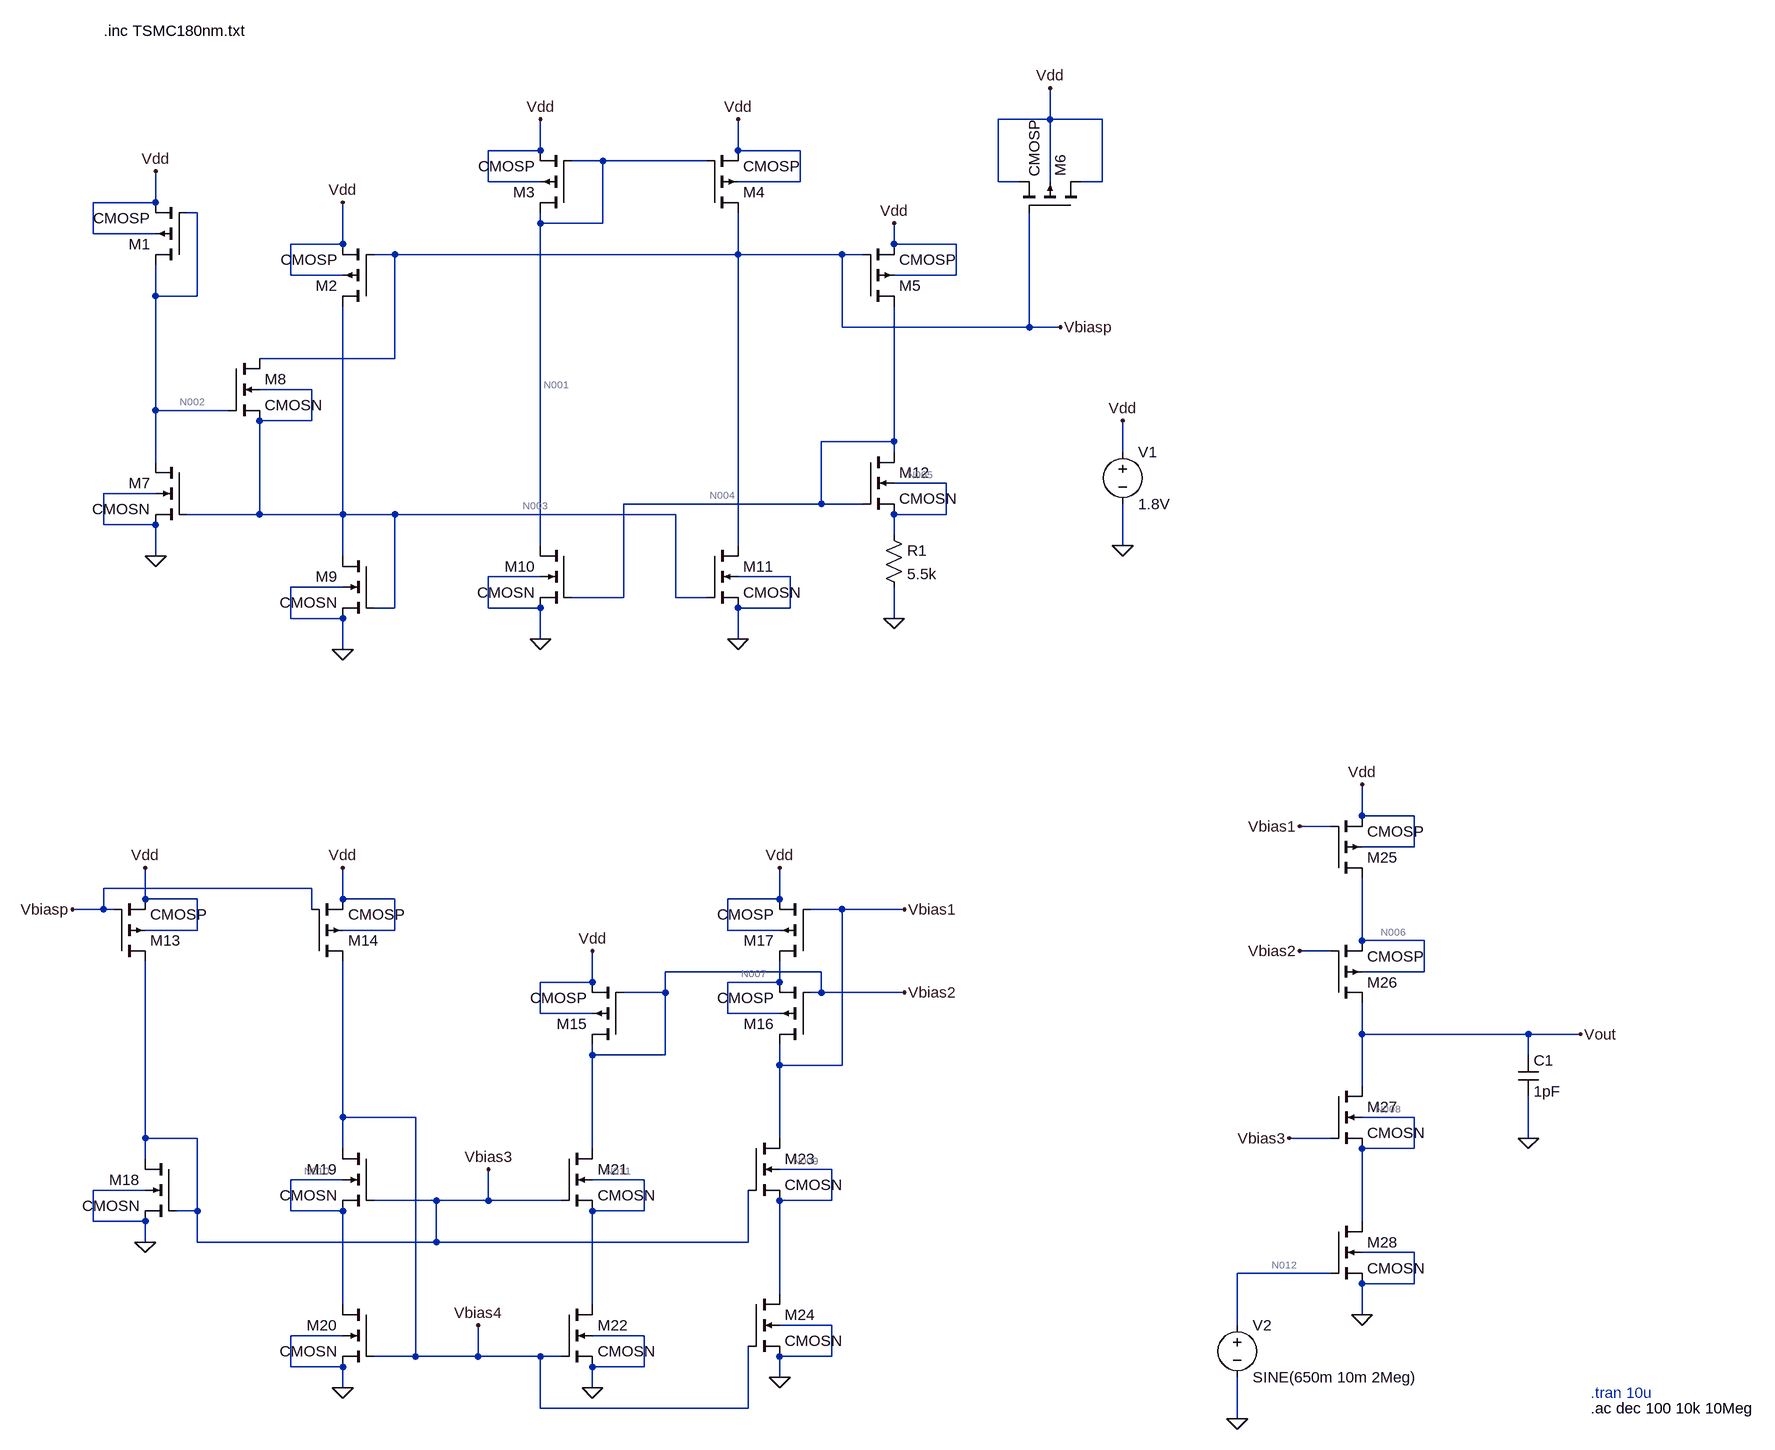
[diagram p0: schematic 180nm_schematic.asc]
180nm_schematic.asc, the LTspice schematic file:
Version 4
SHEET 1 2460 2152
WIRE 1360 112 1360 64
WIRE 1360 112 1280 112
WIRE 1440 112 1360 112
WIRE 576 160 576 112
WIRE 576 160 496 160
WIRE 880 160 880 112
WIRE 976 160 880 160
WIRE 576 176 576 160
WIRE 672 176 624 176
WIRE 832 176 672 176
WIRE 880 176 880 160
WIRE 496 208 496 160
WIRE 576 208 496 208
WIRE 976 208 976 160
WIRE 976 208 880 208
WIRE 1280 208 1280 112
WIRE 1312 208 1280 208
WIRE 1360 208 1360 112
WIRE 1440 208 1440 112
WIRE 1440 208 1408 208
WIRE -16 240 -16 192
WIRE -16 240 -112 240
WIRE 48 256 32 256
WIRE 576 272 576 256
WIRE 672 272 672 176
WIRE 672 272 576 272
WIRE -112 288 -112 240
WIRE -16 288 -112 288
WIRE 272 304 272 240
WIRE 272 304 192 304
WIRE 1120 304 1120 272
WIRE 1216 304 1120 304
WIRE 272 320 272 304
WIRE 352 320 320 320
WIRE 880 320 880 256
WIRE 880 320 352 320
WIRE 1040 320 880 320
WIRE 1072 320 1040 320
WIRE 1120 320 1120 304
WIRE 192 352 192 304
WIRE 272 352 192 352
WIRE 1216 352 1216 304
WIRE 1216 352 1120 352
WIRE -16 384 -16 336
WIRE 48 384 48 256
WIRE 48 384 -16 384
WIRE 1040 432 1040 320
WIRE 1328 432 1328 256
WIRE 1328 432 1040 432
WIRE 1376 432 1328 432
WIRE 352 480 352 320
WIRE 352 480 144 480
WIRE 224 528 144 528
WIRE -16 560 -16 384
WIRE 96 560 -16 560
WIRE 224 576 224 528
WIRE 224 576 144 576
WIRE 1120 608 1120 400
WIRE 1120 608 1008 608
WIRE 1120 624 1120 608
WIRE 1472 624 1472 576
WIRE -16 640 -16 560
WIRE 1200 672 1120 672
WIRE -16 688 -96 688
WIRE 1008 704 1008 608
WIRE 1008 704 704 704
WIRE 1072 704 1008 704
WIRE 144 720 144 576
WIRE 144 720 32 720
WIRE 272 720 272 400
WIRE 272 720 144 720
WIRE 352 720 272 720
WIRE 784 720 352 720
WIRE 1200 720 1200 672
WIRE 1200 720 1120 720
WIRE -96 736 -96 688
WIRE -16 736 -96 736
WIRE 1120 752 1120 720
WIRE 576 768 576 272
WIRE 880 768 880 320
WIRE 1472 768 1472 704
WIRE -16 784 -16 736
WIRE 272 784 272 720
WIRE 576 816 496 816
WIRE 960 816 880 816
WIRE 272 832 192 832
WIRE 704 848 704 704
WIRE 704 848 624 848
WIRE 784 848 784 720
WIRE 832 848 784 848
WIRE 352 864 352 720
WIRE 352 864 320 864
WIRE 496 864 496 816
WIRE 576 864 496 864
WIRE 960 864 960 816
WIRE 960 864 880 864
WIRE 192 880 192 832
WIRE 272 880 192 880
WIRE 1120 880 1120 832
WIRE 576 912 576 864
WIRE 880 912 880 864
WIRE 272 928 272 880
WIRE 1840 1184 1840 1136
WIRE 1920 1184 1840 1184
WIRE 1792 1200 1744 1200
WIRE 1920 1232 1920 1184
WIRE 1920 1232 1840 1232
WIRE 224 1296 -96 1296
WIRE -32 1312 -32 1264
WIRE 48 1312 -32 1312
WIRE 272 1312 272 1264
WIRE 352 1312 272 1312
WIRE 944 1312 944 1264
WIRE 944 1312 864 1312
WIRE -96 1328 -96 1296
WIRE -96 1328 -144 1328
WIRE -80 1328 -96 1328
WIRE 224 1328 224 1296
WIRE 1040 1328 992 1328
WIRE 1136 1328 1040 1328
WIRE 48 1360 48 1312
WIRE 48 1360 -32 1360
WIRE 352 1360 352 1312
WIRE 352 1360 272 1360
WIRE 864 1360 864 1312
WIRE 944 1360 864 1360
WIRE 1840 1376 1840 1280
WIRE 1936 1376 1840 1376
WIRE 1792 1392 1744 1392
WIRE 1008 1424 768 1424
WIRE 1936 1424 1936 1376
WIRE 1936 1424 1840 1424
WIRE 656 1440 656 1392
WIRE 656 1440 576 1440
WIRE 944 1440 944 1408
WIRE 944 1440 864 1440
WIRE 768 1456 768 1424
WIRE 768 1456 704 1456
WIRE 1008 1456 1008 1424
WIRE 1008 1456 992 1456
WIRE 1136 1456 1008 1456
WIRE 576 1488 576 1440
WIRE 656 1488 576 1488
WIRE 864 1488 864 1440
WIRE 944 1488 864 1488
WIRE 1840 1520 1840 1472
WIRE 2096 1520 1840 1520
WIRE 2176 1520 2096 1520
WIRE 656 1552 656 1536
WIRE 768 1552 768 1456
WIRE 768 1552 656 1552
WIRE 2096 1552 2096 1520
WIRE 944 1568 944 1536
WIRE 1040 1568 1040 1328
WIRE 1040 1568 944 1568
WIRE 1840 1600 1840 1520
WIRE 272 1648 272 1408
WIRE 384 1648 272 1648
WIRE 1920 1648 1840 1648
WIRE -32 1680 -32 1408
WIRE 48 1680 -32 1680
WIRE 944 1680 944 1568
WIRE 1792 1680 1728 1680
WIRE 2096 1680 2096 1616
WIRE 272 1696 272 1648
WIRE 656 1696 656 1552
WIRE 1920 1696 1920 1648
WIRE 1920 1696 1840 1696
WIRE -32 1712 -32 1680
WIRE 1024 1728 944 1728
WIRE 272 1744 192 1744
WIRE 736 1744 656 1744
WIRE -32 1760 -112 1760
WIRE 416 1776 320 1776
WIRE 496 1776 496 1728
WIRE 496 1776 416 1776
WIRE 608 1776 496 1776
WIRE 1024 1776 1024 1728
WIRE 1024 1776 944 1776
WIRE 48 1792 48 1680
WIRE 48 1792 16 1792
WIRE 192 1792 192 1744
WIRE 272 1792 192 1792
WIRE 736 1792 736 1744
WIRE 736 1792 656 1792
WIRE -112 1808 -112 1760
WIRE -32 1808 -112 1808
WIRE 1840 1808 1840 1696
WIRE -32 1840 -32 1808
WIRE 48 1840 48 1792
WIRE 416 1840 416 1776
WIRE 416 1840 48 1840
WIRE 896 1840 896 1760
WIRE 896 1840 416 1840
WIRE 1920 1856 1840 1856
WIRE 1792 1888 1648 1888
WIRE 1920 1904 1920 1856
WIRE 1920 1904 1840 1904
WIRE 944 1920 944 1776
WIRE 272 1936 272 1792
WIRE 656 1936 656 1792
WIRE 1840 1952 1840 1904
WIRE 1024 1968 944 1968
WIRE 1648 1968 1648 1888
WIRE 272 1984 192 1984
WIRE 736 1984 656 1984
WIRE 384 2016 384 1648
WIRE 384 2016 320 2016
WIRE 480 2016 480 1968
WIRE 480 2016 384 2016
WIRE 576 2016 480 2016
WIRE 608 2016 576 2016
WIRE 1024 2016 1024 1968
WIRE 1024 2016 944 2016
WIRE 192 2032 192 1984
WIRE 272 2032 192 2032
WIRE 656 2032 656 2016
WIRE 736 2032 736 1984
WIRE 736 2032 656 2032
WIRE 944 2048 944 2016
WIRE 272 2064 272 2032
WIRE 656 2064 656 2032
WIRE 576 2096 576 2016
WIRE 896 2096 896 2000
WIRE 896 2096 576 2096
WIRE 1648 2112 1648 2048
FLAG -16 784 0
FLAG 272 928 0
FLAG 576 912 0
FLAG 880 912 0
FLAG 1120 880 0
FLAG -16 192 Vdd
FLAG 272 240 Vdd
FLAG 576 112 Vdd
FLAG 880 112 Vdd
FLAG 1120 272 Vdd
FLAG 1360 64 Vdd
FLAG 1376 432 Vbiasp
FLAG 1472 768 0
FLAG 1472 576 Vdd
FLAG -32 1840 0
FLAG 272 2064 0
FLAG 656 2064 0
FLAG 944 2048 0
FLAG -32 1264 Vdd
FLAG 272 1264 Vdd
FLAG 656 1392 Vdd
FLAG 944 1264 Vdd
FLAG 1136 1328 Vbias1
FLAG 1136 1456 Vbias2
FLAG -144 1328 Vbiasp
FLAG 496 1728 Vbias3
FLAG 480 1968 Vbias4
FLAG 2096 1680 0
FLAG 1648 2112 0
FLAG 1840 1952 0
FLAG 2176 1520 Vout
FLAG 1840 1136 Vdd
FLAG 1744 1200 Vbias1
FLAG 1744 1392 Vbias2
FLAG 1728 1680 Vbias3
SYMBOL pmos4 32 336 R180
SYMATTR InstName M1
SYMATTR Value2 l=3.6u w=1.8u
SYMATTR Value CMOSP
SYMBOL pmos4 320 400 R180
SYMATTR InstName M2
SYMATTR Value CMOSP
SYMATTR Value2 l=0.36u w=4.32u
SYMBOL pmos4 624 256 R180
SYMATTR InstName M3
SYMATTR Value CMOSP
SYMATTR Value2 l=0.36u w=4.32u
SYMBOL pmos4 832 256 M180
SYMATTR InstName M4
SYMATTR Value CMOSP
SYMATTR Value2 l=0.36u w=4.32u
SYMBOL pmos4 1072 400 M180
SYMATTR InstName M5
SYMATTR Value CMOSP
SYMATTR Value2 l=0.36u w=4.32u
SYMBOL pmos4 1408 256 M270
SYMATTR InstName M6
SYMATTR Value CMOSP
SYMATTR Value2 l=9u w=9u
SYMBOL nmos4 32 640 M0
SYMATTR InstName M7
SYMATTR Value CMOSN
SYMATTR Value2 l=0.36u w=1.8u
SYMBOL nmos4 96 480 R0
SYMATTR InstName M8
SYMATTR Value CMOSN
SYMATTR Value2 l=0.36u w=0.72u
SYMBOL nmos4 320 784 M0
SYMATTR InstName M9
SYMATTR Value CMOSN
SYMATTR Value2 l=0.36u w=1.8u
SYMBOL nmos4 624 768 M0
SYMATTR InstName M10
SYMATTR Value CMOSN
SYMATTR Value2 l=0.36u w=1.8u
SYMBOL nmos4 832 768 R0
SYMATTR InstName M11
SYMATTR Value CMOSN
SYMATTR Value2 l=0.36u w=1.8u
SYMBOL nmos4 1072 624 R0
SYMATTR InstName M12
SYMATTR Value CMOSN
SYMATTR Value2 l=0.36u w=5.4u
SYMBOL res 1104 736 R0
SYMATTR InstName R1
SYMATTR Value 5.5k
SYMBOL voltage 1472 608 R0
WINDOW 123 0 0 Left 0
WINDOW 39 0 0 Left 0
SYMATTR InstName V1
SYMATTR Value 1.8V
SYMBOL pmos4 -80 1408 M180
SYMATTR InstName M13
SYMATTR Value CMOSP
SYMATTR Value2 l=0.36u w=4.32u
SYMBOL pmos4 224 1408 M180
SYMATTR InstName M14
SYMATTR Value CMOSP
SYMATTR Value2 l=0.36u w=4.32u
SYMBOL pmos4 704 1536 R180
SYMATTR InstName M15
SYMATTR Value CMOSP
SYMATTR Value2 l=0.9u w=3.6u
SYMBOL pmos4 992 1536 R180
SYMATTR InstName M16
SYMATTR Value CMOSP
SYMATTR Value2 l=0.36u w=4.32u
SYMBOL pmos4 992 1408 R180
SYMATTR InstName M17
SYMATTR Value CMOSP
SYMATTR Value2 l=0.36u w=4.32u
SYMBOL nmos4 16 1712 M0
SYMATTR InstName M18
SYMATTR Value CMOSN
SYMATTR Value2 l=0.36u w=0.9u
SYMBOL nmos4 320 1696 M0
SYMATTR InstName M19
SYMATTR Value CMOSN
SYMATTR Value2 l=0.36u w=1.8u
SYMBOL nmos4 320 1936 M0
SYMATTR InstName M20
SYMATTR Value CMOSN
SYMATTR Value2 l=0.36u w=1.8u
SYMBOL nmos4 608 1696 R0
SYMATTR InstName M21
SYMATTR Value CMOSN
SYMATTR Value2 l=0.36u w=1.8u
SYMBOL nmos4 608 1936 R0
SYMATTR InstName M22
SYMATTR Value CMOSN
SYMATTR Value2 l=0.36u w=1.8u
SYMBOL nmos4 896 1680 R0
SYMATTR InstName M23
SYMATTR Value CMOSN
SYMATTR Value2 l=0.36u w=1.8u
SYMBOL nmos4 896 1920 R0
SYMATTR InstName M24
SYMATTR Value CMOSN
SYMATTR Value2 l=0.36u w=1.8u
SYMBOL pmos4 1792 1280 M180
SYMATTR InstName M25
SYMATTR Value CMOSP
SYMATTR Value2 l=180n w=3159n
SYMBOL pmos4 1792 1472 M180
SYMATTR InstName M26
SYMATTR Value CMOSP
SYMATTR Value2 l=180n w=3159n
SYMBOL nmos4 1792 1600 R0
SYMATTR InstName M27
SYMATTR Value CMOSN
SYMATTR Value2 l=180n w=641.34n
SYMBOL nmos4 1792 1808 R0
SYMATTR InstName M28
SYMATTR Value CMOSN
SYMATTR Value2 l=180n w=641.34n
SYMBOL voltage 1648 1952 R0
WINDOW 39 0 0 Left 0
SYMATTR Value2 AC 7 0
SYMATTR InstName V2
SYMATTR Value SINE(650m 10m 2Meg)
SYMBOL cap 2080 1552 R0
SYMATTR InstName C1
SYMATTR Value 1pF
TEXT -96 -24 Left 2 !.inc TSMC180nm.txt
TEXT 2192 2072 Left 2 ;.tran 10u
TEXT 2192 2096 Left 2 !.ac dec 100 10k 10Meg

The netlist it stands for:
* 180nm_schematic.asc
M1 N002 N002 Vdd Vdd CMOSP l=3.6u w=1.8u
M2 N003 Vbiasp Vdd Vdd CMOSP l=0.36u w=4.32u
M3 N001 N001 Vdd Vdd CMOSP l=0.36u w=4.32u
M4 Vbiasp N001 Vdd Vdd CMOSP l=0.36u w=4.32u
M5 N004 Vbiasp Vdd Vdd CMOSP l=0.36u w=4.32u
M6 Vdd Vbiasp Vdd Vdd CMOSP l=9u w=9u
M7 N002 N003 0 0 CMOSN l=0.36u w=1.8u
M8 Vbiasp N002 N003 N003 CMOSN l=0.36u w=0.72u
M9 N003 N003 0 0 CMOSN l=0.36u w=1.8u
M10 N001 N004 0 0 CMOSN l=0.36u w=1.8u
M11 Vbiasp N003 0 0 CMOSN l=0.36u w=1.8u
M12 N004 N004 N005 N005 CMOSN l=0.36u w=5.4u
R1 N005 0 5.5k
V1 Vdd 0 1.8V
M13 Vbias3 Vbiasp Vdd Vdd CMOSP l=0.36u w=4.32u
M14 Vbias4 Vbiasp Vdd Vdd CMOSP l=0.36u w=4.32u
M15 Vbias2 Vbias2 Vdd Vdd CMOSP l=0.9u w=3.6u
M16 Vbias1 Vbias2 N007 N007 CMOSP l=0.36u w=4.32u
M17 N007 Vbias1 Vdd Vdd CMOSP l=0.36u w=4.32u
M18 Vbias3 Vbias3 0 0 CMOSN l=0.36u w=0.9u
M19 Vbias4 Vbias3 N010 N010 CMOSN l=0.36u w=1.8u
M20 N010 Vbias4 0 0 CMOSN l=0.36u w=1.8u
M21 Vbias2 Vbias3 N011 N011 CMOSN l=0.36u w=1.8u
M22 N011 Vbias4 0 0 CMOSN l=0.36u w=1.8u
M23 Vbias1 Vbias3 N009 N009 CMOSN l=0.36u w=1.8u
M24 N009 Vbias4 0 0 CMOSN l=0.36u w=1.8u
M25 N006 Vbias1 Vdd Vdd CMOSP l=180n w=3159n
M26 Vout Vbias2 N006 N006 CMOSP l=180n w=3159n
M27 Vout Vbias3 N008 N008 CMOSN l=180n w=641.34n
M28 N008 N012 0 0 CMOSN l=180n w=641.34n
V2 N012 0 SINE(650m 10m 2Meg) AC 7 0
C1 Vout 0 1pF
.model NMOS NMOS
.model PMOS PMOS
.lib standard.mos
.inc TSMC180nm.txt
* .tran 10u
.ac dec 100 10k 10Meg
.backanno
.end

* Results of the author's LTspice run, read from the files saved beside the schematic
* Operating Point, zero values left out:
*   V(n002) = 443.6 mV
*   V(vdd) = 1.8 V
*   V(n003) = 581.1 mV
*   V(vbiasp) = 1.197 V
*   V(n001) = 1.183 V
*   V(n004) = 581.4 mV
*   V(n005) = 61.29 mV
*   V(vbias3) = 629 mV
*   V(vbias4) = 652.4 mV
*   V(vbias2) = 1.066 V
*   V(vbias1) = 1.166 V
*   V(n007) = 1.679 V
*   V(n010) = 48.7 mV
*   V(n011) = 50.76 mV
*   V(n009) = 51.23 mV
*   V(n006) = 1.704 V
*   V(vout) = 1.618 V
*   V(n008) = 68.16 mV
*   V(n012) = 650 mV
*   Id(M1) = -10.86 µA
*   Ib(M1) = 1.366 pA
*   Is(M1) = 10.86 µA
*   Id(M2) = -11.14 µA
*   Ib(M2) = 1.229 pA
*   Is(M2) = 11.14 µA
*   Id(M3) = -12.23 µA
*   Is(M3) = 12.23 µA
*   Id(M4) = -12.21 µA
*   Is(M4) = 12.21 µA
*   Id(M5) = -11.14 µA
*   Ib(M5) = 1.229 pA
*   Is(M5) = 11.14 µA
*   Id(M13) = -11.09 µA
*   Ib(M13) = 1.181 pA
*   Is(M13) = 11.09 µA
*   Id(M14) = -11.07 µA
*   Ib(M14) = 1.158 pA
*   Is(M14) = 11.07 µA
*   Id(M15) = -11.44 µA
*   Is(M15) = 11.44 µA
*   Id(M16) = -11.53 µA
*   Is(M16) = 11.53 µA
*   Id(M17) = -11.53 µA
*   Is(M17) = 11.53 µA
*   Id(M25) = -11.4 µA
*   Is(M25) = 11.4 µA
*   Id(M26) = -11.4 µA
*   Is(M26) = 11.4 µA
*   Id(M7) = 10.86 µA
*   Is(M7) = -10.86 µA
*   Id(M9) = 11.14 µA
*   Is(M9) = -11.14 µA
*   Id(M10) = 12.23 µA
*   Ib(M10) = -1.193 pA
*   Is(M10) = -12.23 µA
*   Id(M11) = 12.21 µA
*   Ib(M11) = -1.207 pA
*   Is(M11) = -12.21 µA
*   Id(M12) = 11.14 µA
*   Is(M12) = -11.14 µA
*   Id(M18) = 11.09 µA
*   Is(M18) = -11.09 µA
*   Id(M19) = 11.07 µA
*   Is(M19) = -11.07 µA
*   Id(M20) = 11.07 µA
*   Is(M20) = -11.07 µA
*   Id(M21) = 11.44 µA
*   Ib(M21) = -1.025 pA
*   Is(M21) = -11.44 µA
*   Id(M22) = 11.44 µA
*   Is(M22) = -11.44 µA
*   Id(M23) = 11.53 µA
*   Ib(M23) = -1.125 pA
*   Is(M23) = -11.53 µA
*   Id(M24) = 11.53 µA
*   Is(M24) = -11.53 µA
*   Id(M27) = 11.4 µA
*   Ib(M27) = -1.56 pA
*   Is(M27) = -11.4 µA
*   Id(M28) = 11.4 µA
*   Is(M28) = -11.4 µA
*   I(R1) = 11.14 µA
*   I(V1) = -114.1 µA
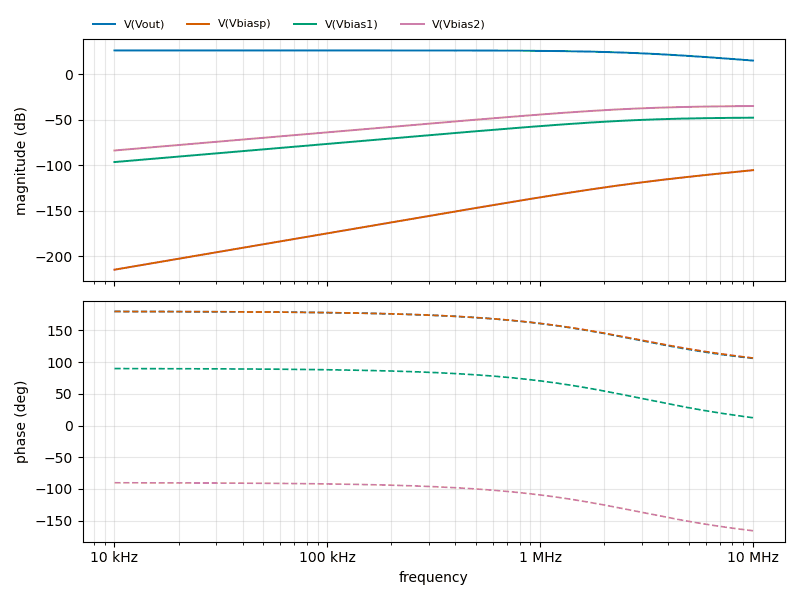
[diagram p1: AC Analysis of 180nm_schematic.asc, plotted from the saved traces]
* AC Analysis, 1 run:
*   V(Vout): 26.04 dB at 10 kHz, 14.84 dB at 10 MHz, peak 26.04 dB at 10 kHz, 3 dB below the peak at 2.867 MHz
*   V(Vbiasp): -214.88 dB at 10 kHz, -105.52 dB at 10 MHz, peak -105.52 dB at 10 MHz, 3 dB below the peak at 7.455 MHz
*   V(Vbias1): -96.62 dB at 10 kHz, -47.91 dB at 10 MHz, peak -47.91 dB at 10 MHz, 3 dB below the peak at 2.61 MHz
*   V(Vbias2): -83.91 dB at 10 kHz, -35.07 dB at 10 MHz, peak -35.07 dB at 10 MHz, 3 dB below the peak at 2.676 MHz